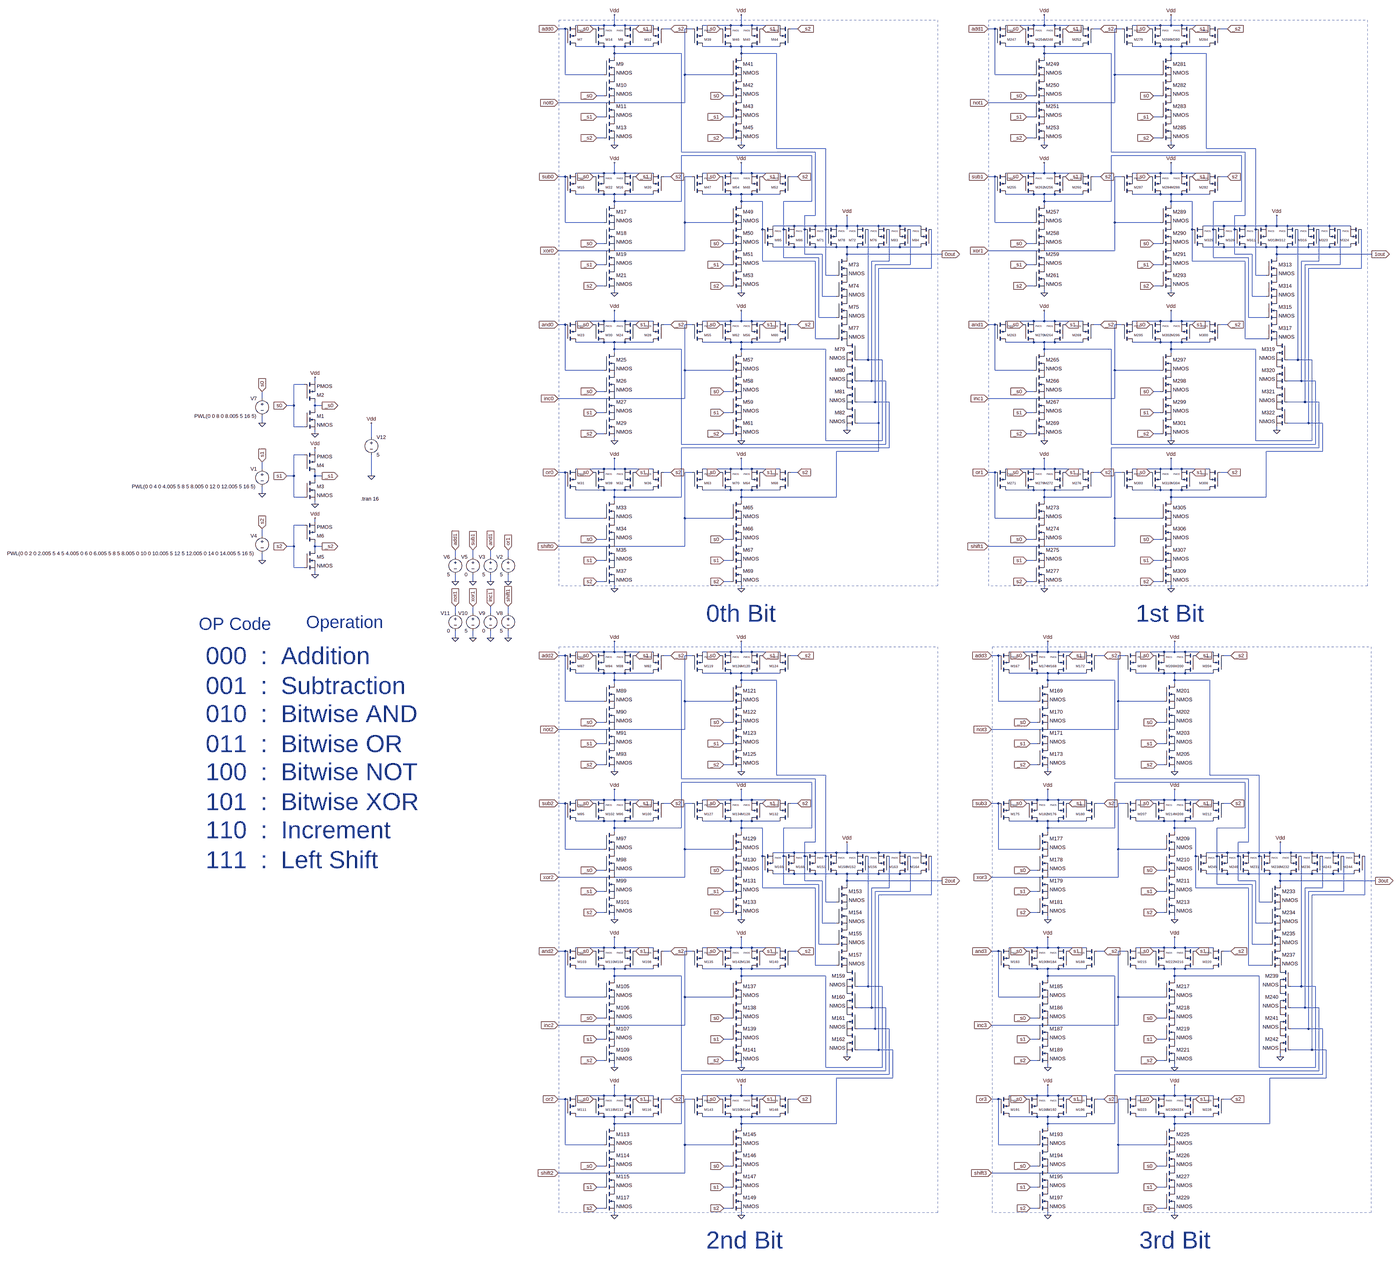
[diagram p0: schematic 4 bit 8 operation Control Unit.asc, whole sheet]
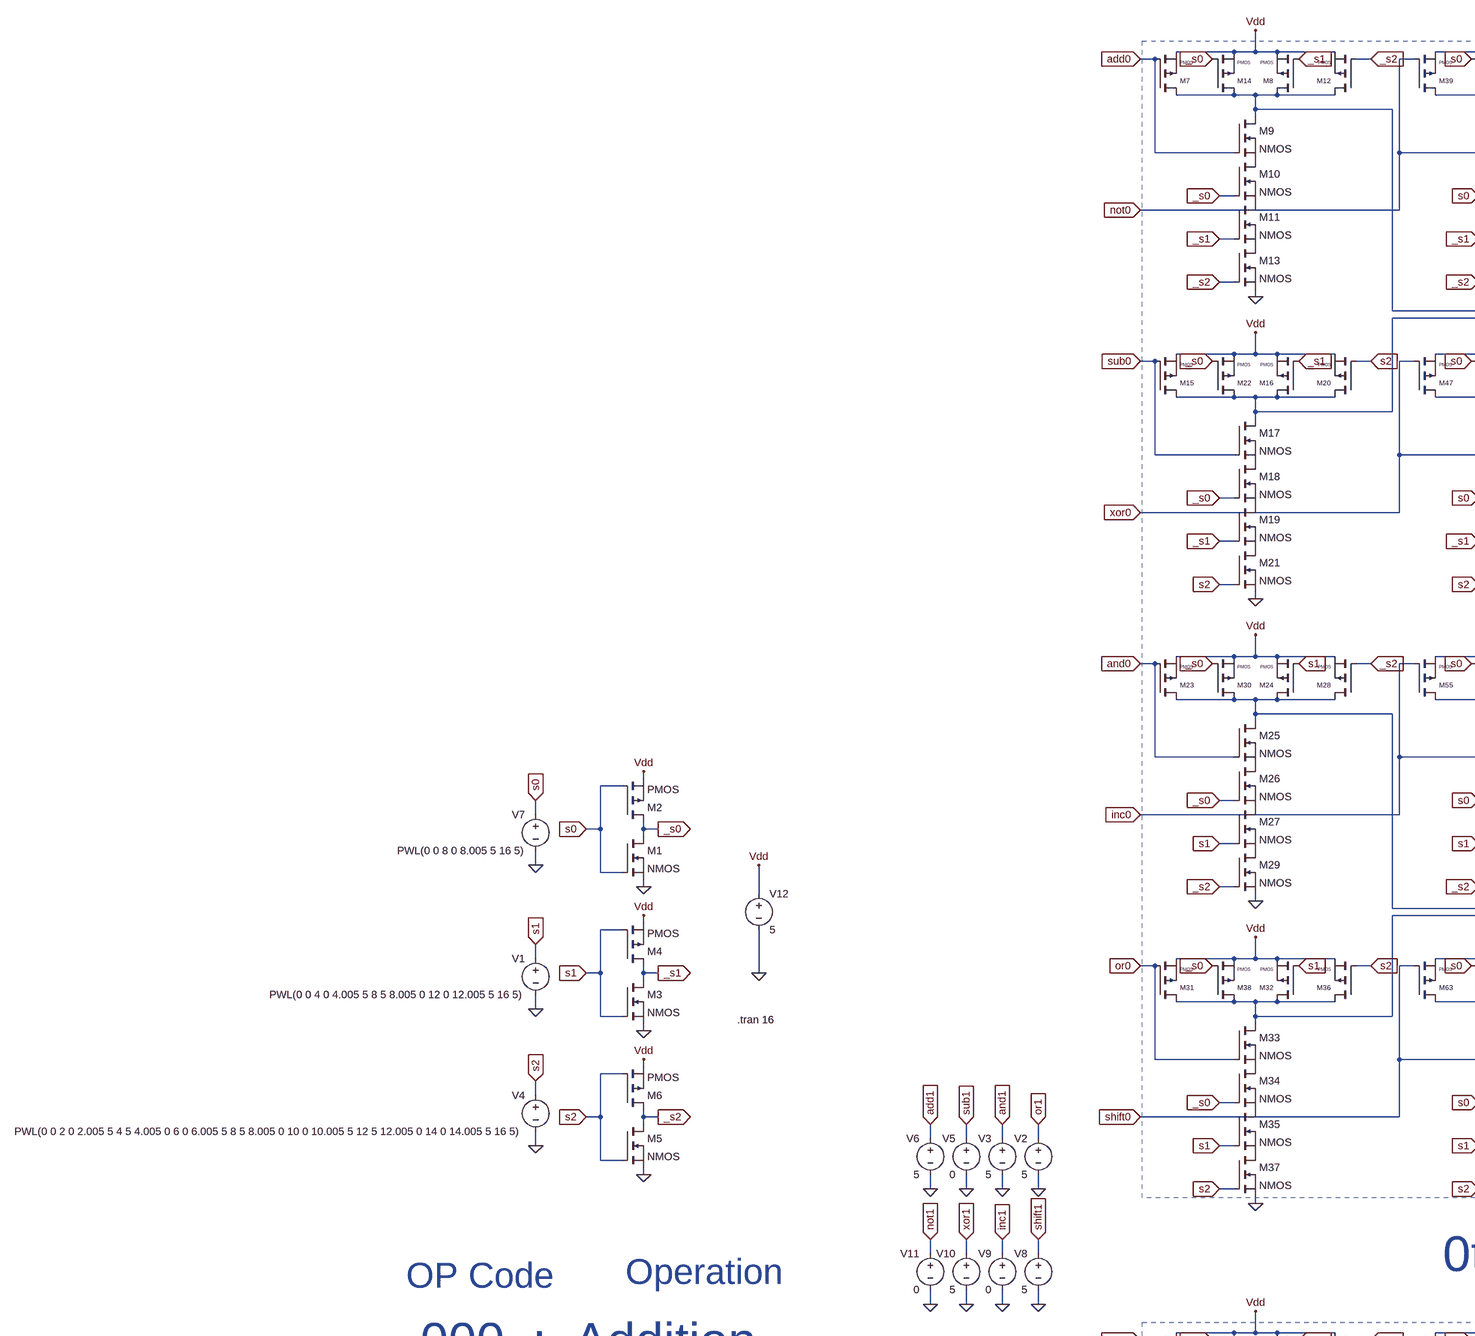
[diagram p1: schematic 4 bit 8 operation Control Unit.asc, part, row 1 of 2, column 1 of 2]
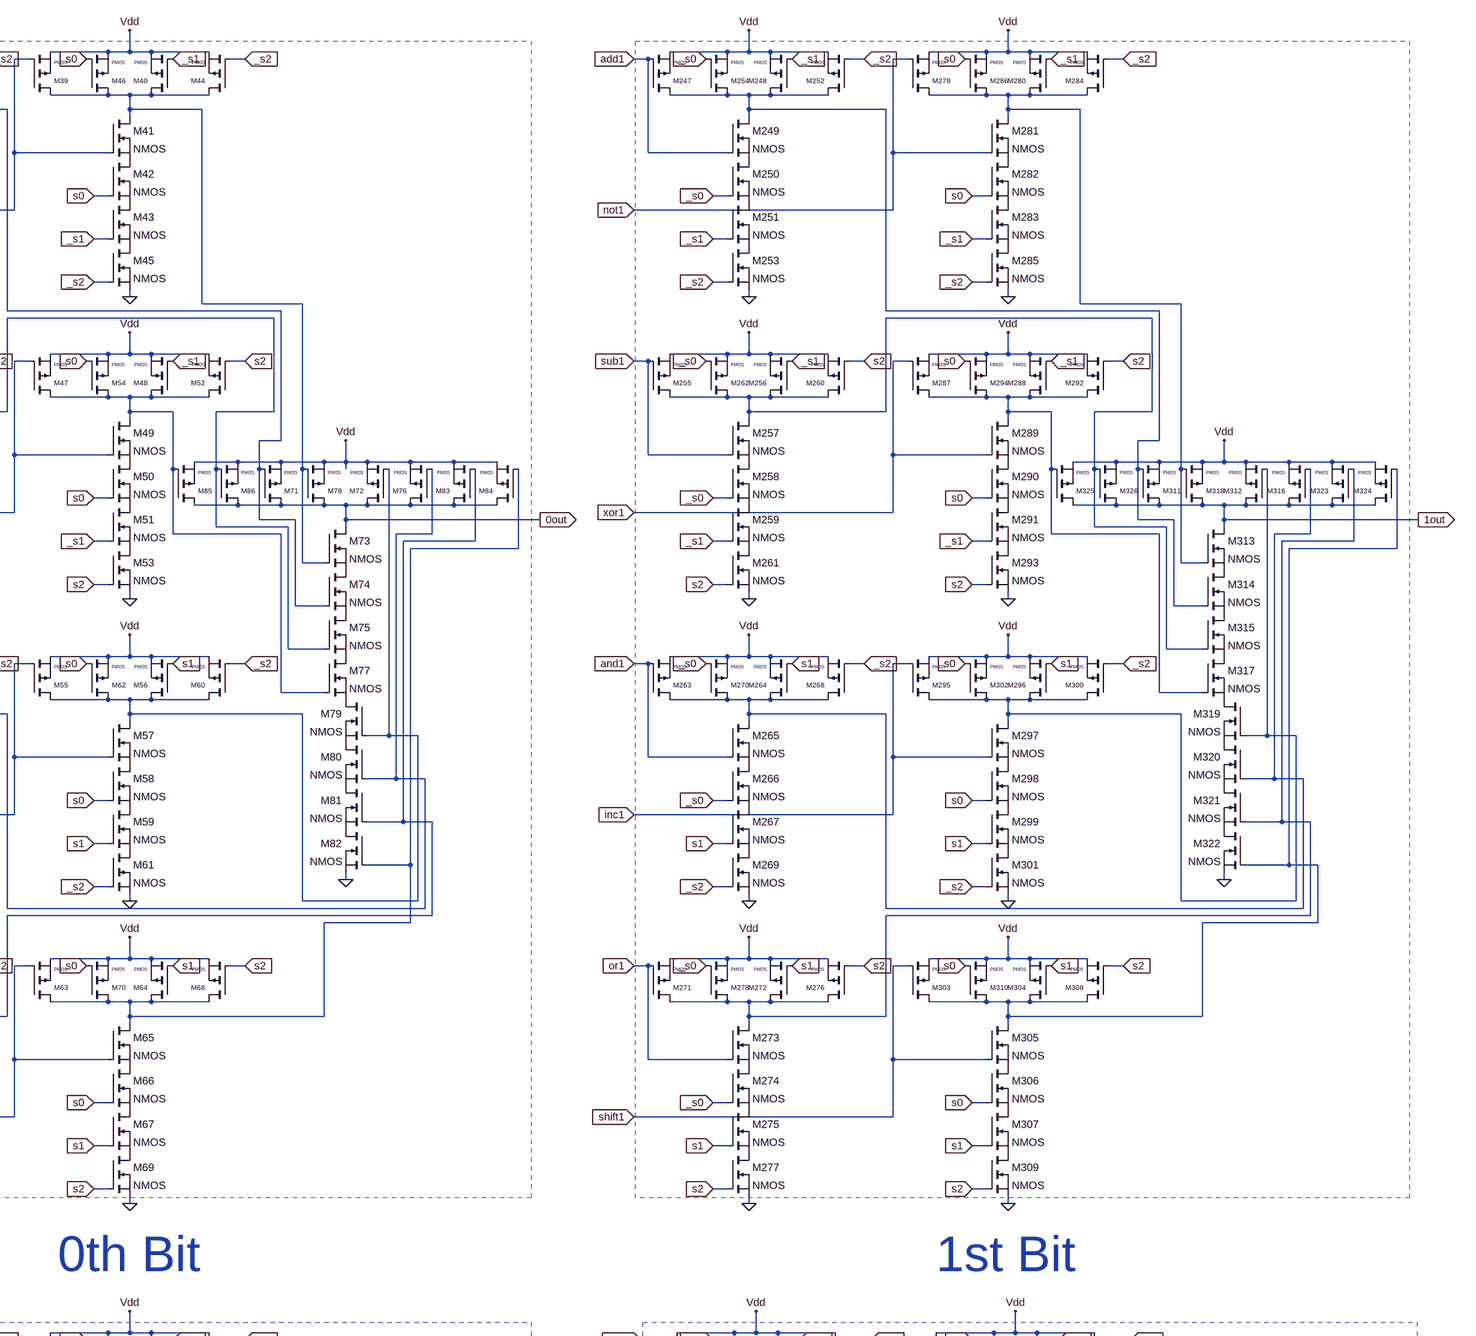
[diagram p2: schematic 4 bit 8 operation Control Unit.asc, part, row 1 of 2, column 2 of 2]
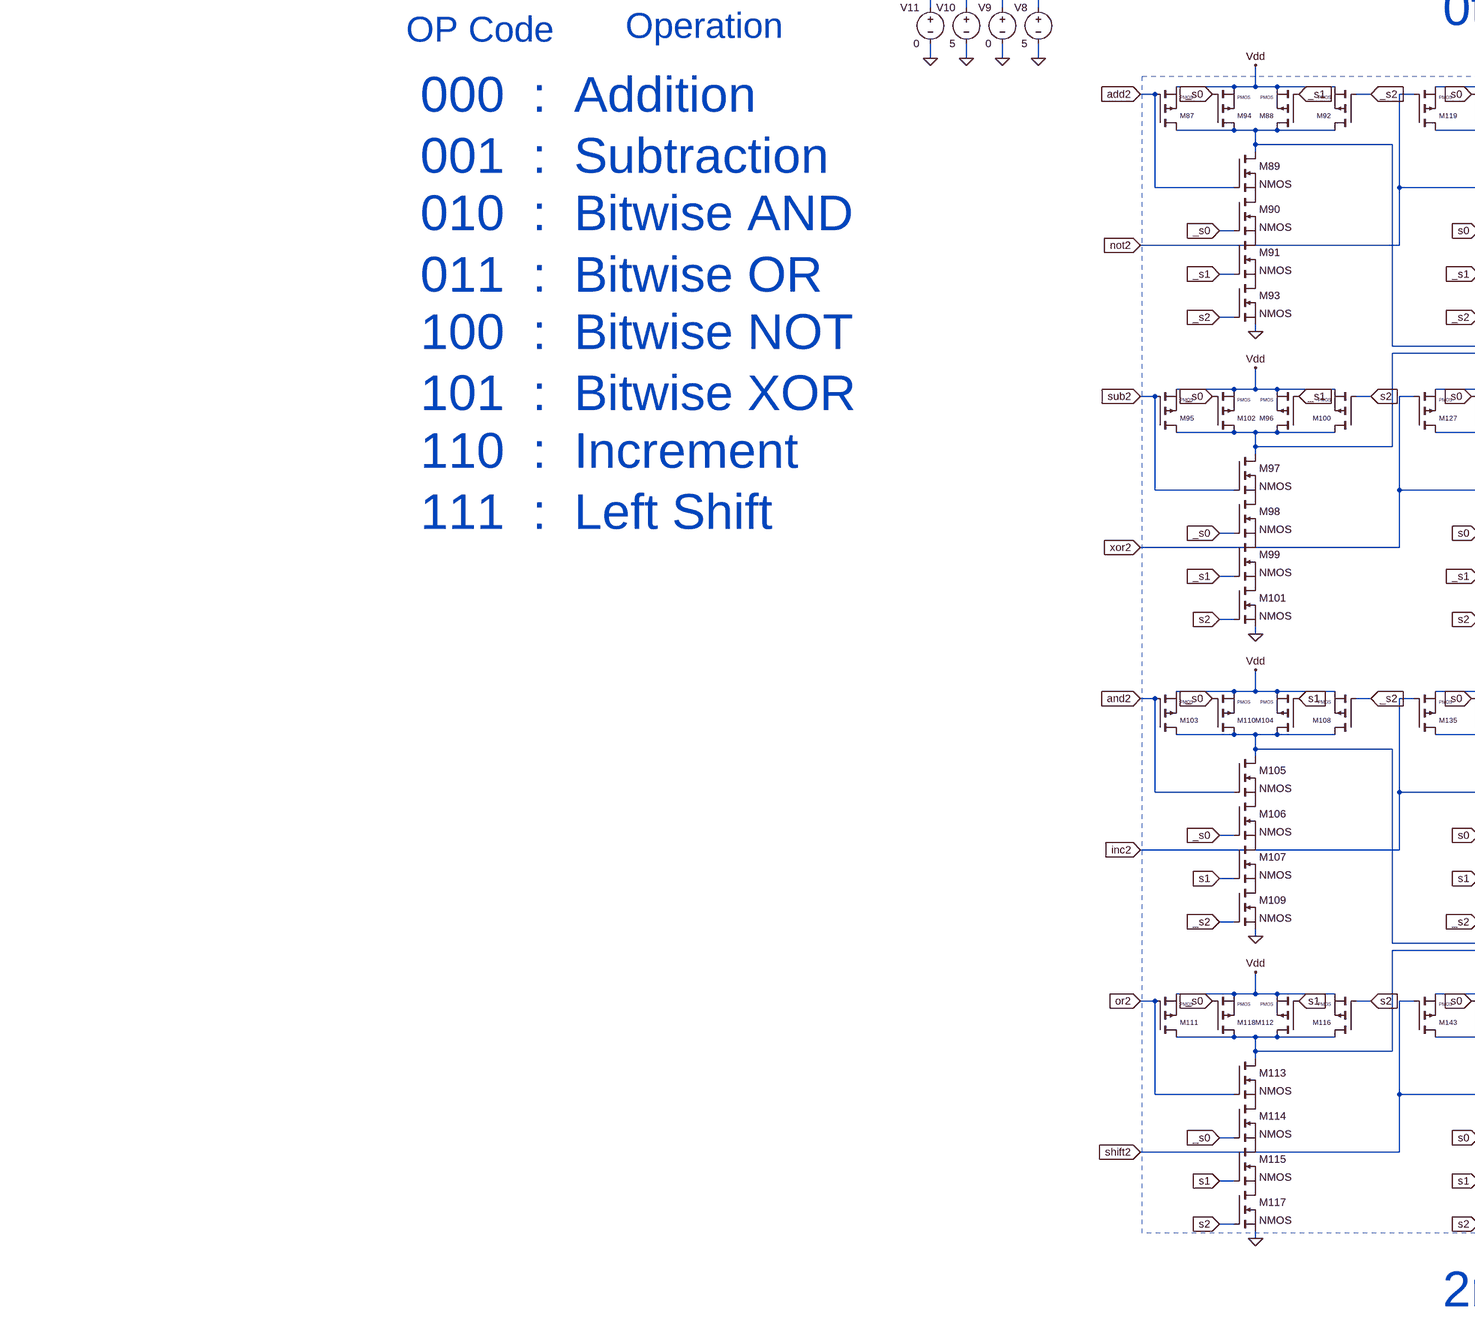
[diagram p3: schematic 4 bit 8 operation Control Unit.asc, part, row 2 of 2, column 1 of 2]
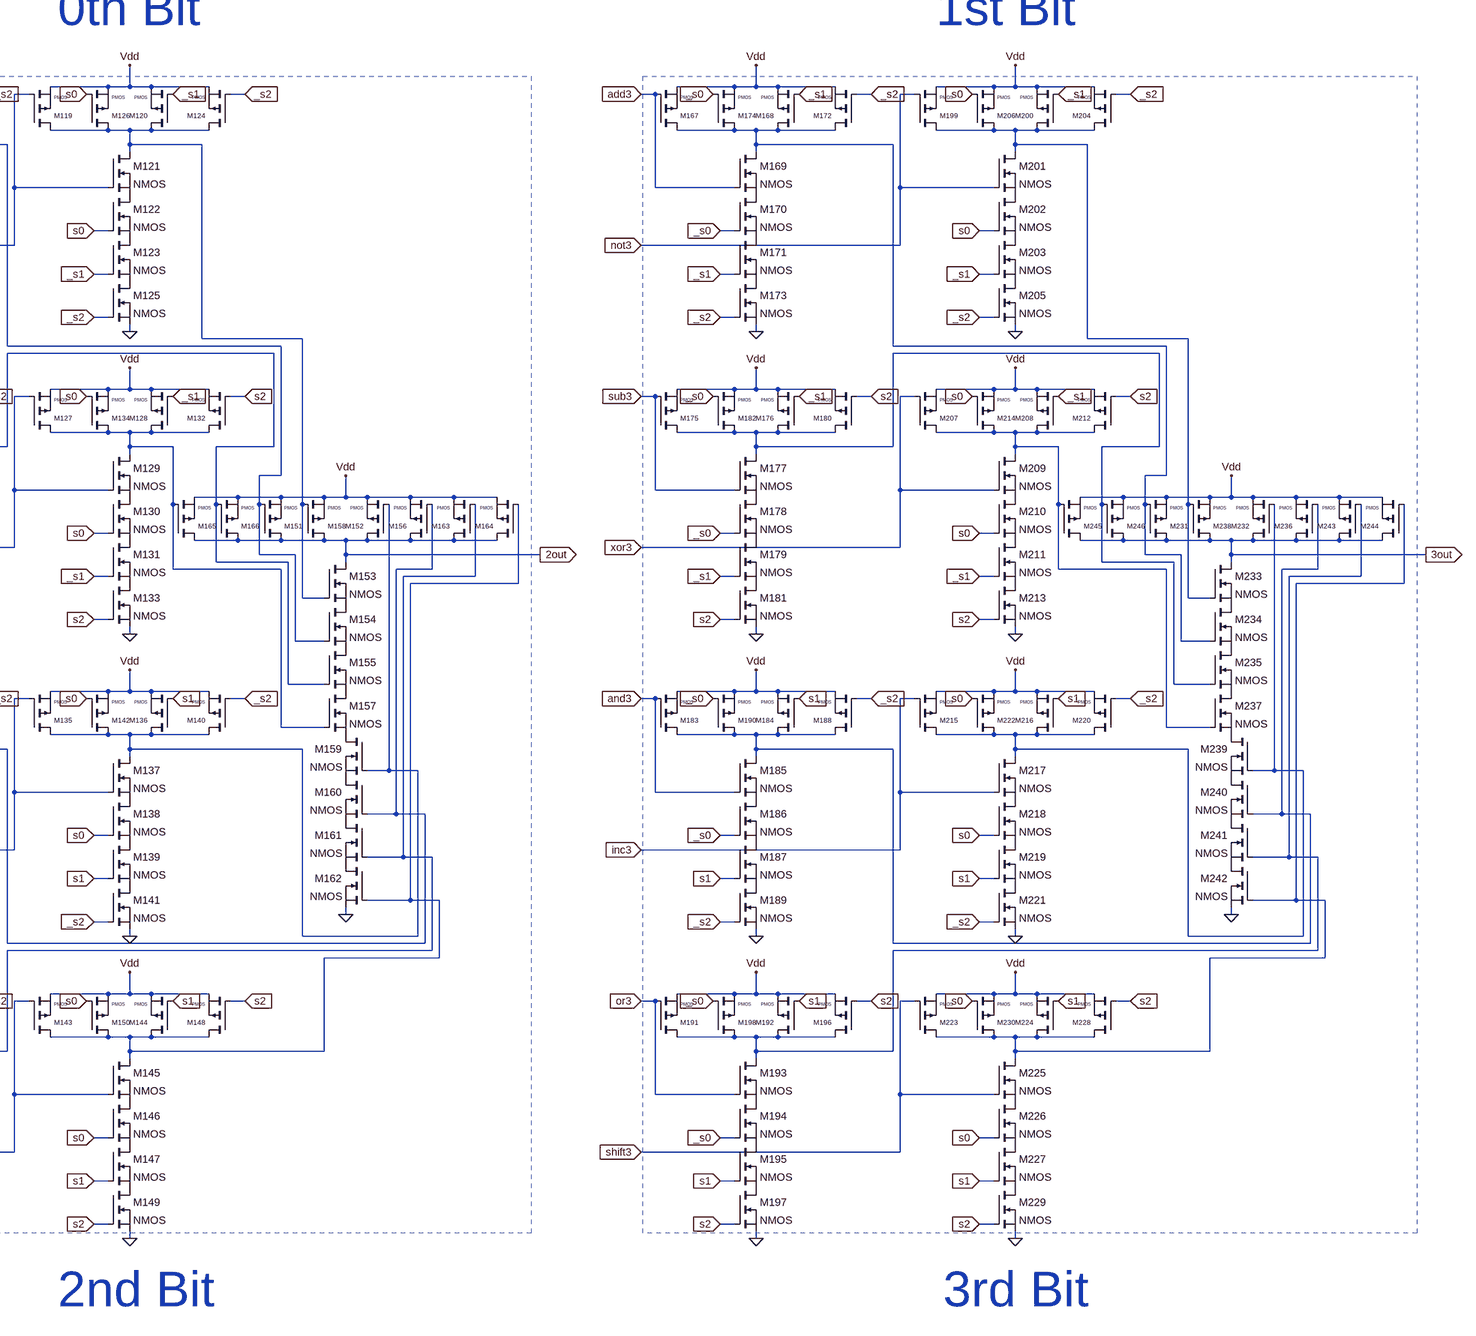
[diagram p4: schematic 4 bit 8 operation Control Unit.asc, part, row 2 of 2, column 2 of 2]
* 4 bit 8 operation Control Unit.asc
V1 s1 0 PWL(0 0 4 0 4.005 5 8 5 8.005 0 12 0 12.005 5 16 5)
V2 or1 0 5
V3 and1 0 5
M1 _s0 s0 0 0 NMOS
M2 _s0 s0 Vdd Vdd PMOS
V4 s2 0 PWL(0 0 2 0 2.005 5 4 5 4.005 0 6 0 6.005 5 8 5 8.005 0 10 0 10.005 5 12 5 12.005 0 14 0 14.005 5 16 5)
M3 _s1 s1 0 0 NMOS
M4 _s1 s1 Vdd Vdd PMOS
V5 sub1 0 0
V6 add1 0 5
V7 s0 0 PWL(0 0 8 0 8.005 5 16 5)
V8 shift1 0 5
V9 inc1 0 0
V10 xor1 0 5
V11 not1 0 0
M5 _s2 s2 0 0 NMOS
M6 _s2 s2 Vdd Vdd PMOS
M7 N001 add0 Vdd Vdd PMOS
M8 N001 _s1 Vdd Vdd PMOS
M9 N001 add0 P001 P001 NMOS
M10 P001 _s0 P002 P002 NMOS
M11 P002 _s1 P003 P003 NMOS
M12 N001 _s2 Vdd Vdd PMOS
M13 P003 _s2 0 0 NMOS
M14 N001 _s0 Vdd Vdd PMOS
M15 N005 sub0 Vdd Vdd PMOS
M16 N005 _s1 Vdd Vdd PMOS
M17 N005 sub0 P004 P004 NMOS
M18 P004 _s0 P005 P005 NMOS
M19 P005 _s1 P006 P006 NMOS
M20 N005 s2 Vdd Vdd PMOS
M21 P006 s2 0 0 NMOS
M22 N005 _s0 Vdd Vdd PMOS
M23 N009 and0 Vdd Vdd PMOS
M24 N009 s1 Vdd Vdd PMOS
M25 N009 and0 P007 P007 NMOS
M26 P007 _s0 P008 P008 NMOS
M27 P008 s1 P009 P009 NMOS
M28 N009 _s2 Vdd Vdd PMOS
M29 P009 _s2 0 0 NMOS
M30 N009 _s0 Vdd Vdd PMOS
M31 N011 or0 Vdd Vdd PMOS
M32 N011 s1 Vdd Vdd PMOS
M33 N011 or0 P010 P010 NMOS
M34 P010 _s0 P011 P011 NMOS
M35 P011 s1 P012 P012 NMOS
M36 N011 s2 Vdd Vdd PMOS
M37 P012 s2 0 0 NMOS
M38 N011 _s0 Vdd Vdd PMOS
M39 N002 not0 Vdd Vdd PMOS
M40 N002 _s1 Vdd Vdd PMOS
M41 N002 not0 P013 P013 NMOS
M42 P013 s0 P014 P014 NMOS
M43 P014 _s1 P015 P015 NMOS
M44 N002 _s2 Vdd Vdd PMOS
M45 P015 _s2 0 0 NMOS
M46 N002 s0 Vdd Vdd PMOS
M47 N007 xor0 Vdd Vdd PMOS
M48 N007 _s1 Vdd Vdd PMOS
M49 N007 xor0 P016 P016 NMOS
M50 P016 s0 P017 P017 NMOS
M51 P017 _s1 P018 P018 NMOS
M52 N007 s2 Vdd Vdd PMOS
M53 P018 s2 0 0 NMOS
M54 N007 s0 Vdd Vdd PMOS
M55 N015 inc0 Vdd Vdd PMOS
M56 N015 s1 Vdd Vdd PMOS
M57 N015 inc0 P019 P019 NMOS
M58 P019 s0 P020 P020 NMOS
M59 P020 s1 P021 P021 NMOS
M60 N015 _s2 Vdd Vdd PMOS
M61 P021 _s2 0 0 NMOS
M62 N015 s0 Vdd Vdd PMOS
M63 N013 shift0 Vdd Vdd PMOS
M64 N013 s1 Vdd Vdd PMOS
M65 N013 shift0 P022 P022 NMOS
M66 P022 s0 P023 P023 NMOS
M67 P023 s1 P024 P024 NMOS
M68 N013 s2 Vdd Vdd PMOS
M69 P024 s2 0 0 NMOS
M70 N013 s0 Vdd Vdd PMOS
M71 0out N001 Vdd Vdd PMOS
M72 0out N015 Vdd Vdd PMOS
M73 0out N002 P025 P025 NMOS
M74 P025 N001 P026 P026 NMOS
M75 P026 N005 P027 P027 NMOS
M76 0out N009 Vdd Vdd PMOS
M77 P027 N007 P028 P028 NMOS
M78 0out N002 Vdd Vdd PMOS
M79 P028 N015 P029 P029 NMOS
M80 P029 N009 P030 P030 NMOS
M81 P030 N011 P031 P031 NMOS
M82 P031 N013 0 0 NMOS
M83 0out N011 Vdd Vdd PMOS
M84 0out N013 Vdd Vdd PMOS
M85 0out N007 Vdd Vdd PMOS
M86 0out N005 Vdd Vdd PMOS
V12 Vdd 0 5
M87 N017 add2 Vdd Vdd PMOS
M88 N017 _s1 Vdd Vdd PMOS
M89 N017 add2 P032 P032 NMOS
M90 P032 _s0 P033 P033 NMOS
M91 P033 _s1 P034 P034 NMOS
M92 N017 _s2 Vdd Vdd PMOS
M93 P034 _s2 0 0 NMOS
M94 N017 _s0 Vdd Vdd PMOS
M95 N021 sub2 Vdd Vdd PMOS
M96 N021 _s1 Vdd Vdd PMOS
M97 N021 sub2 P035 P035 NMOS
M98 P035 _s0 P036 P036 NMOS
M99 P036 _s1 P037 P037 NMOS
M100 N021 s2 Vdd Vdd PMOS
M101 P037 s2 0 0 NMOS
M102 N021 _s0 Vdd Vdd PMOS
M103 N025 and2 Vdd Vdd PMOS
M104 N025 s1 Vdd Vdd PMOS
M105 N025 and2 P038 P038 NMOS
M106 P038 _s0 P039 P039 NMOS
M107 P039 s1 P040 P040 NMOS
M108 N025 _s2 Vdd Vdd PMOS
M109 P040 _s2 0 0 NMOS
M110 N025 _s0 Vdd Vdd PMOS
M111 N027 or2 Vdd Vdd PMOS
M112 N027 s1 Vdd Vdd PMOS
M113 N027 or2 P041 P041 NMOS
M114 P041 _s0 P042 P042 NMOS
M115 P042 s1 P043 P043 NMOS
M116 N027 s2 Vdd Vdd PMOS
M117 P043 s2 0 0 NMOS
M118 N027 _s0 Vdd Vdd PMOS
M119 N018 not2 Vdd Vdd PMOS
M120 N018 _s1 Vdd Vdd PMOS
M121 N018 not2 P044 P044 NMOS
M122 P044 s0 P045 P045 NMOS
M123 P045 _s1 P046 P046 NMOS
M124 N018 _s2 Vdd Vdd PMOS
M125 P046 _s2 0 0 NMOS
M126 N018 s0 Vdd Vdd PMOS
M127 N023 xor2 Vdd Vdd PMOS
M128 N023 _s1 Vdd Vdd PMOS
M129 N023 xor2 P047 P047 NMOS
M130 P047 s0 P048 P048 NMOS
M131 P048 _s1 P049 P049 NMOS
M132 N023 s2 Vdd Vdd PMOS
M133 P049 s2 0 0 NMOS
M134 N023 s0 Vdd Vdd PMOS
M135 N031 inc2 Vdd Vdd PMOS
M136 N031 s1 Vdd Vdd PMOS
M137 N031 inc2 P050 P050 NMOS
M138 P050 s0 P051 P051 NMOS
M139 P051 s1 P052 P052 NMOS
M140 N031 _s2 Vdd Vdd PMOS
M141 P052 _s2 0 0 NMOS
M142 N031 s0 Vdd Vdd PMOS
M143 N029 shift2 Vdd Vdd PMOS
M144 N029 s1 Vdd Vdd PMOS
M145 N029 shift2 P053 P053 NMOS
M146 P053 s0 P054 P054 NMOS
M147 P054 s1 P055 P055 NMOS
M148 N029 s2 Vdd Vdd PMOS
M149 P055 s2 0 0 NMOS
M150 N029 s0 Vdd Vdd PMOS
M151 2out N017 Vdd Vdd PMOS
M152 2out N031 Vdd Vdd PMOS
M153 2out N018 P056 P056 NMOS
M154 P056 N017 P057 P057 NMOS
M155 P057 N021 P058 P058 NMOS
M156 2out N025 Vdd Vdd PMOS
M157 P058 N023 P059 P059 NMOS
M158 2out N018 Vdd Vdd PMOS
M159 P059 N031 P060 P060 NMOS
M160 P060 N025 P061 P061 NMOS
M161 P061 N027 P062 P062 NMOS
M162 P062 N029 0 0 NMOS
M163 2out N027 Vdd Vdd PMOS
M164 2out N029 Vdd Vdd PMOS
M165 2out N023 Vdd Vdd PMOS
M166 2out N021 Vdd Vdd PMOS
M167 N019 add3 Vdd Vdd PMOS
M168 N019 _s1 Vdd Vdd PMOS
M169 N019 add3 P063 P063 NMOS
M170 P063 _s0 P064 P064 NMOS
M171 P064 _s1 P065 P065 NMOS
M172 N019 _s2 Vdd Vdd PMOS
M173 P065 _s2 0 0 NMOS
M174 N019 _s0 Vdd Vdd PMOS
M175 N022 sub3 Vdd Vdd PMOS
M176 N022 _s1 Vdd Vdd PMOS
M177 N022 sub3 P066 P066 NMOS
M178 P066 _s0 P067 P067 NMOS
M179 P067 _s1 P068 P068 NMOS
M180 N022 s2 Vdd Vdd PMOS
M181 P068 s2 0 0 NMOS
M182 N022 _s0 Vdd Vdd PMOS
M183 N026 and3 Vdd Vdd PMOS
M184 N026 s1 Vdd Vdd PMOS
M185 N026 and3 P069 P069 NMOS
M186 P069 _s0 P070 P070 NMOS
M187 P070 s1 P071 P071 NMOS
M188 N026 _s2 Vdd Vdd PMOS
M189 P071 _s2 0 0 NMOS
M190 N026 _s0 Vdd Vdd PMOS
M191 N028 or3 Vdd Vdd PMOS
M192 N028 s1 Vdd Vdd PMOS
M193 N028 or3 P072 P072 NMOS
M194 P072 _s0 P073 P073 NMOS
M195 P073 s1 P074 P074 NMOS
M196 N028 s2 Vdd Vdd PMOS
M197 P074 s2 0 0 NMOS
M198 N028 _s0 Vdd Vdd PMOS
M199 N020 not3 Vdd Vdd PMOS
M200 N020 _s1 Vdd Vdd PMOS
M201 N020 not3 P075 P075 NMOS
M202 P075 s0 P076 P076 NMOS
M203 P076 _s1 P077 P077 NMOS
M204 N020 _s2 Vdd Vdd PMOS
M205 P077 _s2 0 0 NMOS
M206 N020 s0 Vdd Vdd PMOS
M207 N024 xor3 Vdd Vdd PMOS
M208 N024 _s1 Vdd Vdd PMOS
M209 N024 xor3 P078 P078 NMOS
M210 P078 s0 P079 P079 NMOS
M211 P079 _s1 P080 P080 NMOS
M212 N024 s2 Vdd Vdd PMOS
M213 P080 s2 0 0 NMOS
M214 N024 s0 Vdd Vdd PMOS
M215 N032 inc3 Vdd Vdd PMOS
M216 N032 s1 Vdd Vdd PMOS
M217 N032 inc3 P081 P081 NMOS
M218 P081 s0 P082 P082 NMOS
M219 P082 s1 P083 P083 NMOS
M220 N032 _s2 Vdd Vdd PMOS
M221 P083 _s2 0 0 NMOS
M222 N032 s0 Vdd Vdd PMOS
M223 N030 shift3 Vdd Vdd PMOS
M224 N030 s1 Vdd Vdd PMOS
M225 N030 shift3 P084 P084 NMOS
M226 P084 s0 P085 P085 NMOS
M227 P085 s1 P086 P086 NMOS
M228 N030 s2 Vdd Vdd PMOS
M229 P086 s2 0 0 NMOS
M230 N030 s0 Vdd Vdd PMOS
M231 3out N019 Vdd Vdd PMOS
M232 3out N032 Vdd Vdd PMOS
M233 3out N020 P087 P087 NMOS
M234 P087 N019 P088 P088 NMOS
M235 P088 N022 P089 P089 NMOS
M236 3out N026 Vdd Vdd PMOS
M237 P089 N024 P090 P090 NMOS
M238 3out N020 Vdd Vdd PMOS
M239 P090 N032 P091 P091 NMOS
M240 P091 N026 P092 P092 NMOS
M241 P092 N028 P093 P093 NMOS
M242 P093 N030 0 0 NMOS
M243 3out N028 Vdd Vdd PMOS
M244 3out N030 Vdd Vdd PMOS
M245 3out N024 Vdd Vdd PMOS
M246 3out N022 Vdd Vdd PMOS
M247 N003 add1 Vdd Vdd PMOS
M248 N003 _s1 Vdd Vdd PMOS
M249 N003 add1 P094 P094 NMOS
M250 P094 _s0 P095 P095 NMOS
M251 P095 _s1 P096 P096 NMOS
M252 N003 _s2 Vdd Vdd PMOS
M253 P096 _s2 0 0 NMOS
M254 N003 _s0 Vdd Vdd PMOS
M255 N006 sub1 Vdd Vdd PMOS
M256 N006 _s1 Vdd Vdd PMOS
M257 N006 sub1 P097 P097 NMOS
M258 P097 _s0 P098 P098 NMOS
M259 P098 _s1 P099 P099 NMOS
M260 N006 s2 Vdd Vdd PMOS
M261 P099 s2 0 0 NMOS
M262 N006 _s0 Vdd Vdd PMOS
M263 N010 and1 Vdd Vdd PMOS
M264 N010 s1 Vdd Vdd PMOS
M265 N010 and1 P100 P100 NMOS
M266 P100 _s0 P101 P101 NMOS
M267 P101 s1 P102 P102 NMOS
M268 N010 _s2 Vdd Vdd PMOS
M269 P102 _s2 0 0 NMOS
M270 N010 _s0 Vdd Vdd PMOS
M271 N012 or1 Vdd Vdd PMOS
M272 N012 s1 Vdd Vdd PMOS
M273 N012 or1 P103 P103 NMOS
M274 P103 _s0 P104 P104 NMOS
M275 P104 s1 P105 P105 NMOS
M276 N012 s2 Vdd Vdd PMOS
M277 P105 s2 0 0 NMOS
M278 N012 _s0 Vdd Vdd PMOS
M279 N004 not1 Vdd Vdd PMOS
M280 N004 _s1 Vdd Vdd PMOS
M281 N004 not1 P106 P106 NMOS
M282 P106 s0 P107 P107 NMOS
M283 P107 _s1 P108 P108 NMOS
M284 N004 _s2 Vdd Vdd PMOS
M285 P108 _s2 0 0 NMOS
M286 N004 s0 Vdd Vdd PMOS
M287 N008 xor1 Vdd Vdd PMOS
M288 N008 _s1 Vdd Vdd PMOS
M289 N008 xor1 P109 P109 NMOS
M290 P109 s0 P110 P110 NMOS
M291 P110 _s1 P111 P111 NMOS
M292 N008 s2 Vdd Vdd PMOS
M293 P111 s2 0 0 NMOS
M294 N008 s0 Vdd Vdd PMOS
M295 N016 inc1 Vdd Vdd PMOS
M296 N016 s1 Vdd Vdd PMOS
M297 N016 inc1 P112 P112 NMOS
M298 P112 s0 P113 P113 NMOS
M299 P113 s1 P114 P114 NMOS
M300 N016 _s2 Vdd Vdd PMOS
M301 P114 _s2 0 0 NMOS
M302 N016 s0 Vdd Vdd PMOS
M303 N014 shift1 Vdd Vdd PMOS
M304 N014 s1 Vdd Vdd PMOS
M305 N014 shift1 P115 P115 NMOS
M306 P115 s0 P116 P116 NMOS
M307 P116 s1 P117 P117 NMOS
M308 N014 s2 Vdd Vdd PMOS
M309 P117 s2 0 0 NMOS
M310 N014 s0 Vdd Vdd PMOS
M311 1out N003 Vdd Vdd PMOS
M312 1out N016 Vdd Vdd PMOS
M313 1out N004 P118 P118 NMOS
M314 P118 N003 P119 P119 NMOS
M315 P119 N006 P120 P120 NMOS
M316 1out N010 Vdd Vdd PMOS
M317 P120 N008 P121 P121 NMOS
M318 1out N004 Vdd Vdd PMOS
M319 P121 N016 P122 P122 NMOS
M320 P122 N010 P123 P123 NMOS
M321 P123 N012 P124 P124 NMOS
M322 P124 N014 0 0 NMOS
M323 1out N012 Vdd Vdd PMOS
M324 1out N014 Vdd Vdd PMOS
M325 1out N008 Vdd Vdd PMOS
M326 1out N006 Vdd Vdd PMOS
.model NMOS NMOS
.model PMOS PMOS
.lib standard.mos
* 000  :  Addition
* OP Code
* Operation
* 001  :  Subtraction
* 010  :  Bitwise AND
* 011  :  Bitwise OR
* 100  :  Bitwise NOT
* 101  :  Bitwise XOR
* 110  :  Increment
* 111  :  Left Shift
.tran 16
* 0th Bit
* 2nd Bit
* 3rd Bit
* 1st Bit
.backanno
.end